# Altium schematic sheet stm32F103_64PIN_MINI_SYS.SchDoc
size A4
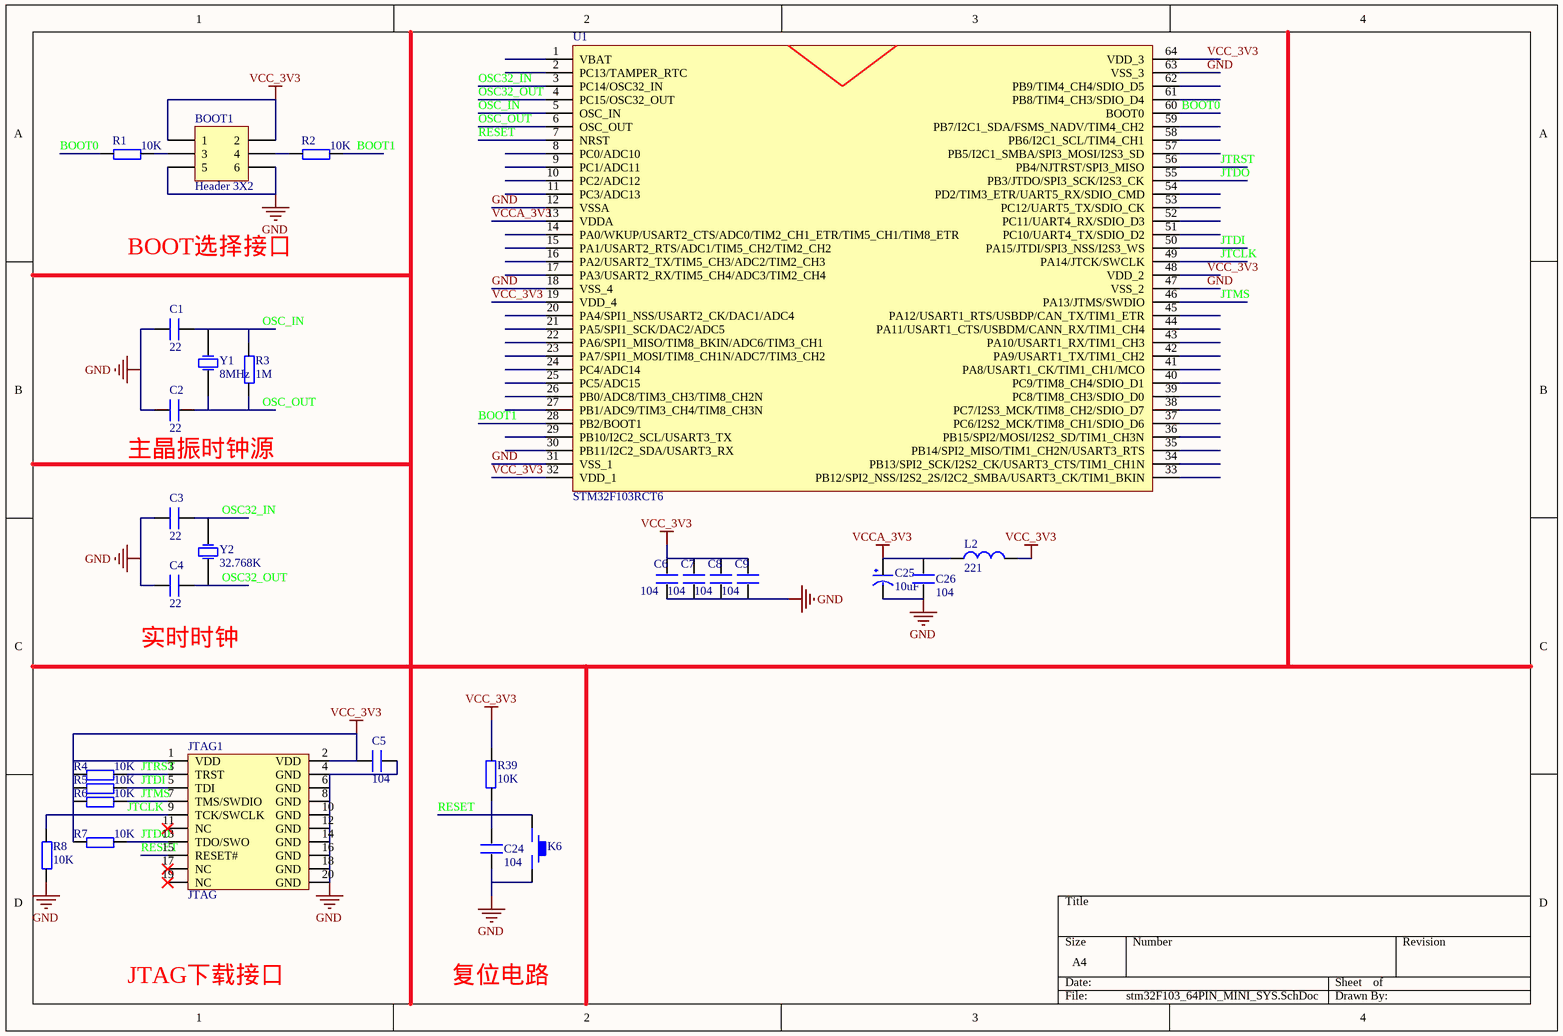
[diagram p0: stm32F103_64PIN_MINI_SYS.SchDoc]

## Parts
BOOT1  Header 3X2  [HDR2X3]
C1  22  [0603P]
C2  22  [0603P]
C3  22  [0603P]
C4  22  [0603P]
C5  104  [0603P]
C6  104  [0603P]
C7  104  [0603P]
C8  104  [0603P]
C9  104  [0603P]
C24  104  [0603P]
C25  10uF  [CC6.56.5]
C26  104  [0603P]
JTAG1  JTAG  [JTAG_20]
K6  KEY  [KEY2]  (value not drawn)
L2  221  [INDC4532]
R1  10K  [0603P]
R2  10K  [0603P]
R3  1M  [0603P]
R4  10K  [0603P]
R5  10K  [0603P]
R6  10K  [0603P]
R7  10K  [0603P]
R8  10K  [0603P]
R39  10K  [0603P]
U1  STM32F103RCT6  [STM-LQFP64_N]
Y1  8MHz  [XTAL_US]
Y2  32.768K  [XTAL_US]

## Nets
GND: BOOT1.5 BOOT1.6 C1.1 C2.1 C3.1 C4.1 C5.2 C6.1 C7.1 C8.1 C9.1 C24.1 C25.2(GND) C26.1 JTAG1.4(GND) JTAG1.6(GND) JTAG1.8(GND) JTAG1.10(GND) JTAG1.12(GND) JTAG1.14(GND) JTAG1.16(GND) JTAG1.18(GND) JTAG1.20(GND) K6.1 R8.1 U1.12(VSSA) U1.18(VSS_4) U1.31(VSS_1) U1.47(VSS_2) U1.63(VSS_3)
VCC_3V3: BOOT1.1 BOOT1.2 C5.1 C6.2 C7.2 C8.2 C9.2 JTAG1.1(VDD) JTAG1.2(VDD) L2.2 R4.1 R5.1 R6.1 R7.1 R39.2 U1.19(VDD_4) U1.32(VDD_1) U1.48(VDD_2) U1.64(VDD_3)
VCCA_3V3: C25.1(VCC) C26.2 L2.1 U1.13(VDDA)
BOOT0: R1.1 U1.60(BOOT0)
BOOT1: R2.2 U1.28(PB2/BOOT1)
JTCLK: JTAG1.9(TCK/SWCLK) R8.2 U1.49(PA14/JTCK/SWCLK)
JTDI: JTAG1.5(TDI) R5.2 U1.50(PA15/JTDI/SPI3_NSS/I2S3_WS)
JTDO: JTAG1.13(TDO/SWO) R7.2 U1.55(PB3/JTDO/SPI3_SCK/I2S3_CK)
JTMS: JTAG1.7(TMS/SWDIO) R6.2 U1.46(PA13/JTMS/SWDIO)
JTRST: JTAG1.3(TRST) R4.2 U1.56(PB4/NJTRST/SPI3_MISO)
OSC32_IN: C3.2 U1.3(PC14/OSC32_IN) Y2.2(OSC2)
OSC32_OUT: C4.2 U1.4(PC15/OSC32_OUT) Y2.1(OSC1)
OSC_IN: C1.2 R3.2 U1.5(OSC_IN) Y1.2(OSC2)
OSC_OUT: C2.2 R3.1 U1.6(OSC_OUT) Y1.1(OSC1)
RESET: C24.2 JTAG1.15(RESET#) K6.2 R39.1 U1.7(NRST)
NetBOOT1_3: BOOT1.3 R1.2
NetBOOT1_4: BOOT1.4 R2.1

Not connected (* = marked no-connect by the designer): JTAG1 11(NC)* 17(NC)* 19(NC)*; U1 1(VBAT) 2(PC13/TAMPER_RTC) 8(PC0/ADC10) 9(PC1/ADC11) 10(PC2/ADC12) 11(PC3/ADC13) 14(PA0/WKUP/USART2_CTS/ADC0/TIM2_CH1_ETR/TIM5_CH1/TIM8_ETR) 15(PA1/USART2_RTS/ADC1/TIM5_CH2/TIM2_CH2) 16(PA2/USART2_TX/TIM5_CH3/ADC2/TIM2_CH3) 17(PA3/USART2_RX/TIM5_CH4/ADC3/TIM2_CH4) 20(PA4/SPI1_NSS/USART2_CK/DAC1/ADC4) 21(PA5/SPI1_SCK/DAC2/ADC5) 22(PA6/SPI1_MISO/TIM8_BKIN/ADC6/TIM3_CH1) 23(PA7/SPI1_MOSI/TIM8_CH1N/ADC7/TIM3_CH2) 24(PC4/ADC14) 25(PC5/ADC15) 26(PB0/ADC8/TIM3_CH3/TIM8_CH2N) 27(PB1/ADC9/TIM3_CH4/TIM8_CH3N) 29(PB10/I2C2_SCL/USART3_TX) 30(PB11/I2C2_SDA/USART3_RX) 33(PB12/SPI2_NSS/I2S2_2S/I2C2_SMBA/USART3_CK/TIM1_BKIN) 34(PB13/SPI2_SCK/I2S2_CK/USART3_CTS/TIM1_CH1N) 35(PB14/SPI2_MISO/TIM1_CH2N/USART3_RTS) 36(PB15/SPI2/MOSI/I2S2_SD/TIM1_CH3N) 37(PC6/I2S2_MCK/TIM8_CH1/SDIO_D6) 38(PC7/I2S3_MCK/TIM8_CH2/SDIO_D7) 39(PC8/TIM8_CH3/SDIO_D0) 40(PC9/TIM8_CH4/SDIO_D1) 41(PA8/USART1_CK/TIM1_CH1/MCO) 42(PA9/USART1_TX/TIM1_CH2) 43(PA10/USART1_RX/TIM1_CH3) 44(PA11/USART1_CTS/USBDM/CANN_RX/TIM1_CH4) 45(PA12/USART1_RTS/USBDP/CAN_TX/TIM1_ETR) 51(PC10/UART4_TX/SDIO_D2) 52(PC11/UART4_RX/SDIO_D3) 53(PC12/UART5_TX/SDIO_CK) 54(PD2/TIM3_ETR/UART5_RX/SDIO_CMD) 57(PB5/I2C1_SMBA/SPI3_MOSI/I2S3_SD) 58(PB6/I2C1_SCL/TIM4_CH1) 59(PB7/I2C1_SDA/FSMS_NADV/TIM4_CH2) 61(PB8/TIM4_CH3/SDIO_D4) 62(PB9/TIM4_CH4/SDIO_D5)

## Notes on the sheet
- BOOT选择接口
- (near C2) 主晶振时钟源
- (near C4) 实时时钟
- JTAG下载接口
- 复位电路

## Library data of the parts
BOOT1 = Header 3X2: Header, 3-Pin, Dual row; LatestRevisionDate: 17-Jul-2002; LatestRevisionNote: Re-released for DXP Platform.; Publisher: Altium Limited
C1-C9 C24 C26 = C
C25 = CAP
L2 = Inductor: Value: 221
R1-R8 R39 = R
Y1 Y2 = XTAL: Crystal Oscillator; Published: 8-Jun-2000; LatestRevisionDate: 17-Jul-2002; LatestRevisionNote: Re-released for DXP Platform.; Publisher: Altium Limited